# EAGLE schematic schematic (EAGLE 8.6.0)
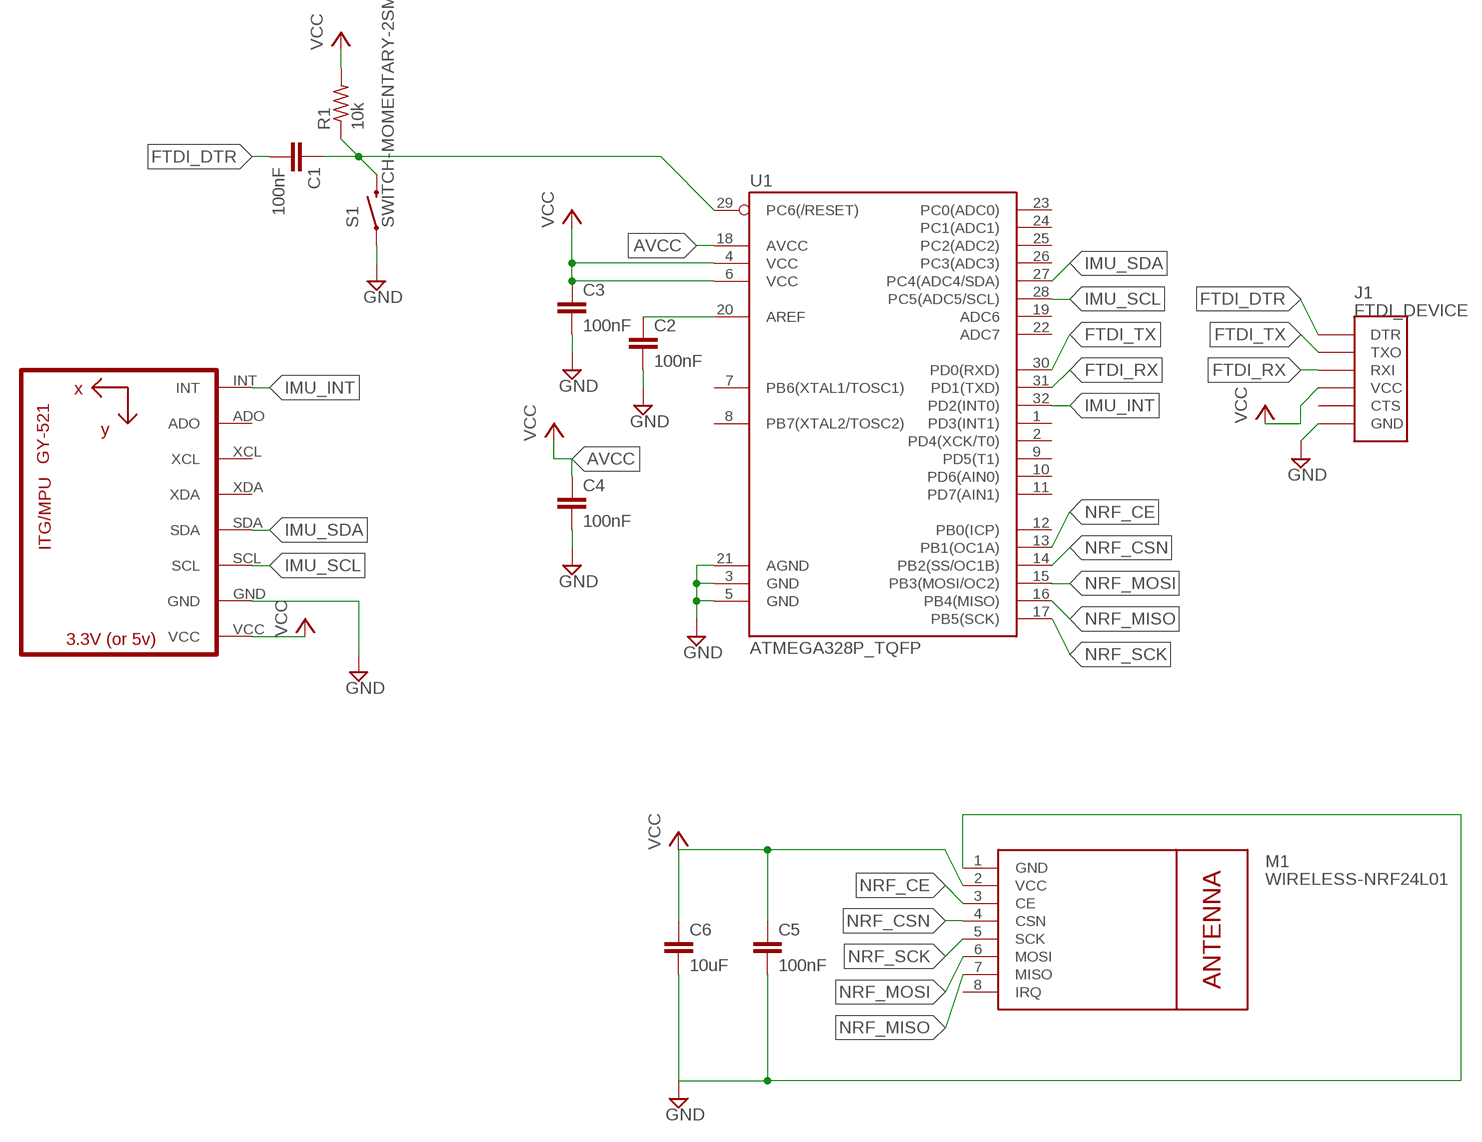
[diagram p0: schematic, sheet 1]

## Parts
C1  100nF  C-EUC0603  [C0603]
C2  100nF  C-EUC0603  [C0603]
C3  100nF  C-EUC0603  [C0603]
C4  100nF  C-EUC0603  [C0603]
C5  100nF  C-EUC0603  [C0603]
C6  10uF  C-EUC0603  [C0603]
J1  FTDI_DEVICE  [FTDI_DEVICE_SIDE]
M1  WIRELESS-NRF24L01  [WIRELESS-NRF24L01]
R1  10k  R-US_R0603  [R0603]
S1  SWITCH-MOMENTARY-2SMD  [TACTILE-SWITCH-SMD]
U1  ATMEGA328P_TQFP  [TQFP32-08]
U2  GY-521MPU6050  [GY-521]

## Nets
AVCC: C4.1 U1.18(AVCC)
FTDI_DTR: C1.2 J1.P$1(DTR)
FTDI_RX: J1.P$3(RXI) U1.31(PD1(TXD))
FTDI_TX: J1.P$2(TXO) U1.30(PD0(RXD))
GND: C2.2 C3.2 J1.P$6(GND) S1.1 U1.3(GND) U1.5(GND) U1.21(AGND) U2.GND
IMU_INT: U1.32(PD2(INT0)) U2.INT
IMU_SCL: U1.28(PC5(ADC5/SCL)) U2.SCL
IMU_SDA: U1.27(PC4(ADC4/SDA)) U2.SDA
N$1: C1.1 R1.1 S1.3
N$2: C2.1 U1.20(AREF)
N$4: C5.2 C6.2 M1.1(GND)
NRF_CE: M1.3(CE) U1.13(PB1(OC1A))
NRF_CSN: M1.4(CSN) U1.14(PB2(SS/OC1B))
NRF_MISO: M1.7(MISO) U1.16(PB4(MISO))
NRF_MOSI: M1.6(MOSI) U1.15(PB3(MOSI/OC2))
NRF_SCK: M1.5(SCK) U1.17(PB5(SCK))
VCC: C3.1 C5.1 C6.1 J1.P$4(VCC) M1.2(VCC) R1.2 U1.4(VCC) U1.6(VCC) U2.VCC
Unconnected: C4.2 J1.P$5(CTS) M1.8(IRQ) U1.1(PD3(INT1)) U1.2(PD4(XCK/T0)) U1.7(PB6(XTAL1/TOSC1)) U1.8(PB7(XTAL2/TOSC2)) U1.9(PD5(T1)) U1.10(PD6(AIN0)) U1.11(PD7(AIN1)) U1.12(PB0(ICP)) U1.19(ADC6) U1.22(ADC7) U1.23(PC0(ADC0)) U1.24(PC1(ADC1)) U1.25(PC2(ADC2)) U1.26(PC3(ADC3)) U1.29(PC6(/RESET)) U2.ADO U2.XCL U2.XDA

## Library data of the parts
C1-C6 = rcl:C-EU: CAPACITOR, European symbol; SPICEPREFIX: C
J1 = quad:FTDI_DEVICE: Connector which mates to FTDI basic or FTDI cable.
M1 = quad:WIRELESS-NRF24L01: 2.4 GHz Wireless Module based on NRF24L01 chip
R1 = rcl:R-US_: RESISTOR, American symbol; SPICEPREFIX: R
S1 = quad:SWITCH-MOMENTARY-2: Various NO switches- pushbuttons, reed, etc; PROD_ID: SWCH-08247
U1 = quad:ATMEGA328P_TQFP; PROD_ID: IC-09069
U2 = quad:GY-521